# EAGLE design ADM3202_conv (EAGLE 7.7.0)
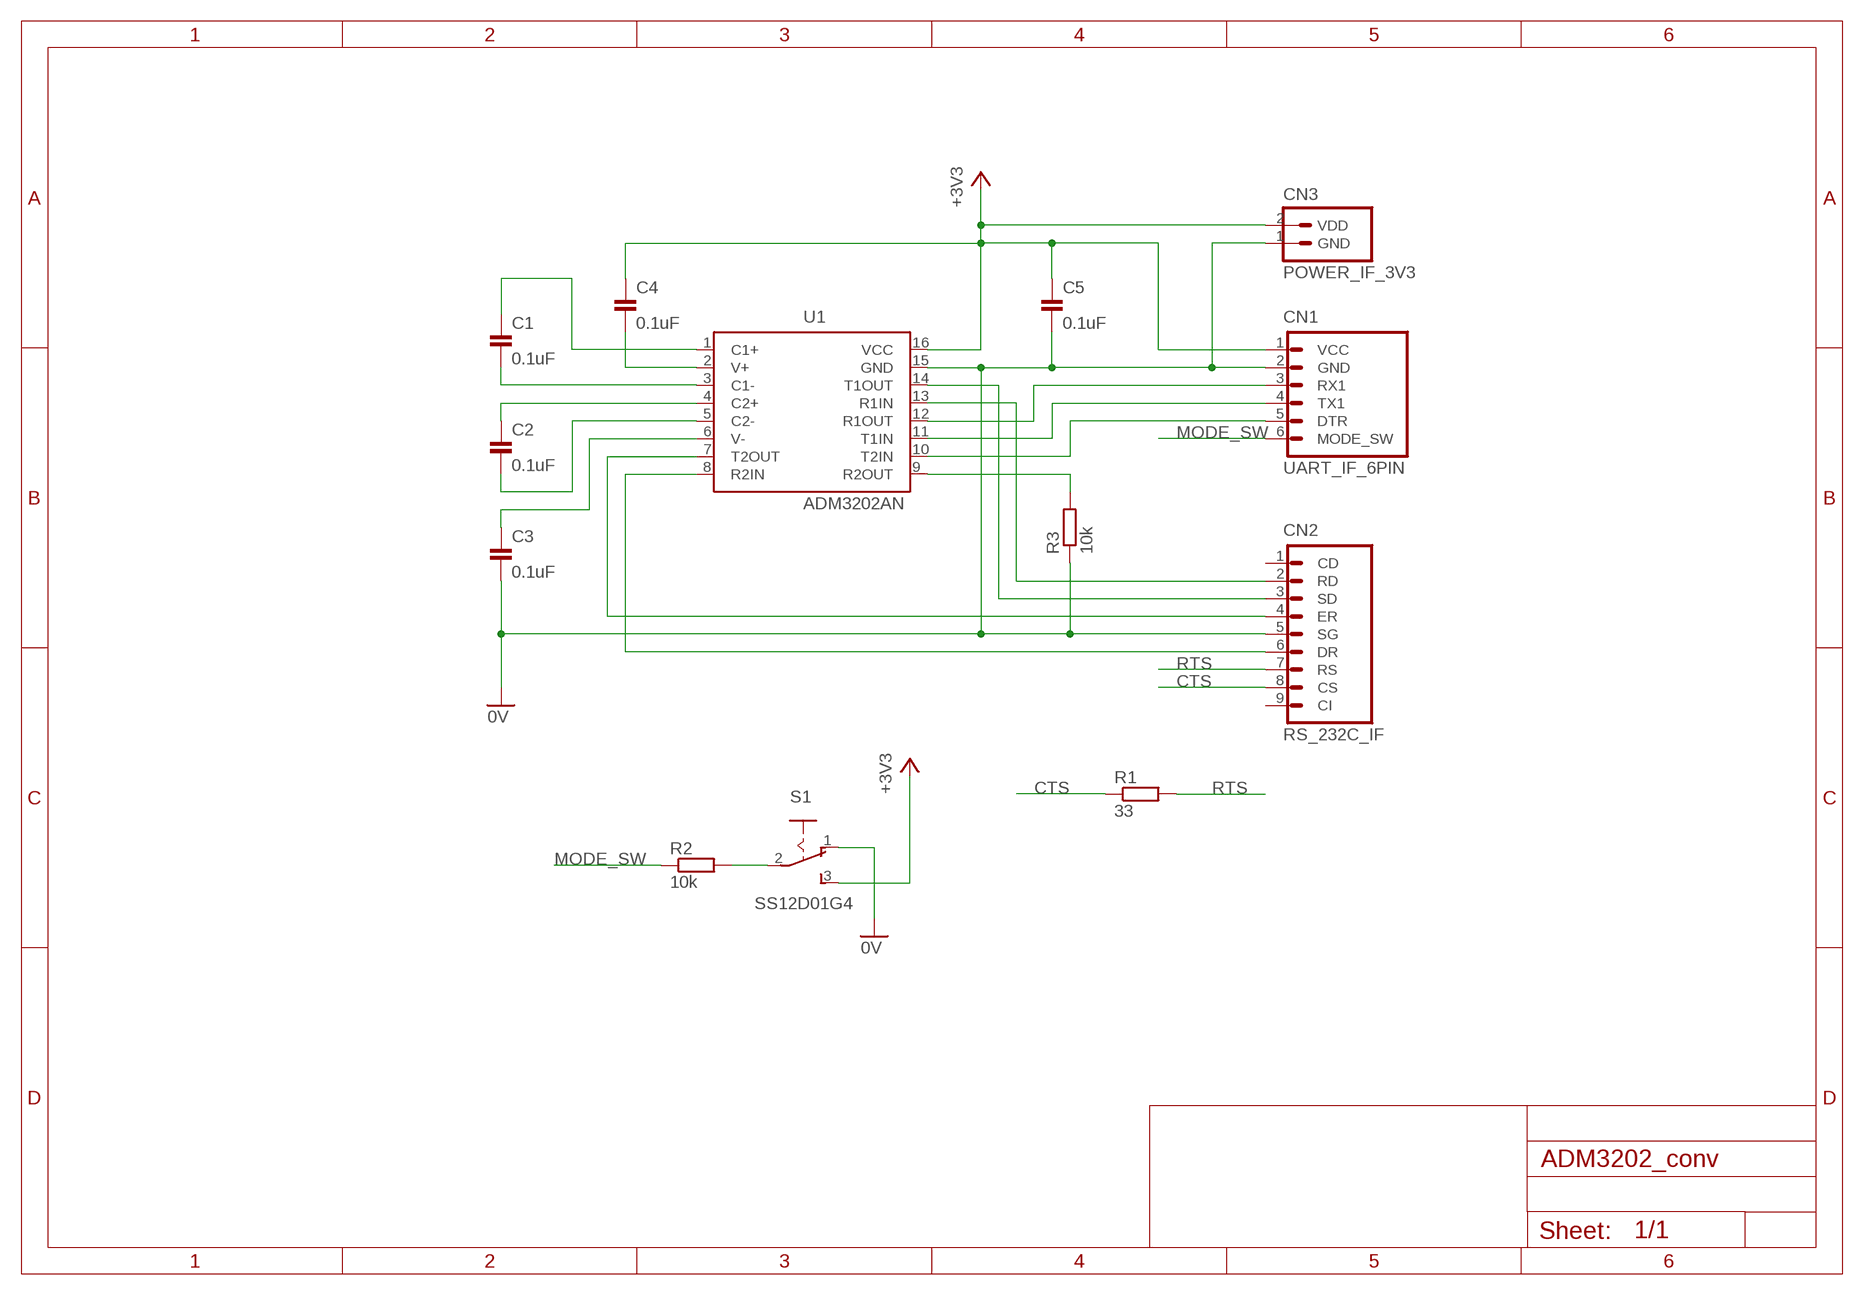
[diagram p0: schematic, sheet 1]

## Parts
C1  0.1uF  CAP_0805_DEV  [SMD_2012_DEV]
C2  0.1uF  CAP_0805_DEV  [SMD_2012_DEV]
C3  0.1uF  CAP_0805_DEV  [SMD_2012_DEV]
C4  0.1uF  CAP_0805_DEV  [SMD_2012_DEV]
C5  0.1uF  CAP_0805_DEV  [SMD_2012_DEV]
CN1  UART_IF_6PIN  [UART_IF_6PIN]
CN2  RS_232C_IF  UM04_RS_232C_IF  [UM04_RS_232C_IF_9PIN]
CN3  POWER_IF_3V3  [HEADER_2PIN_3V3_IF]
R1  33  RESISTOR_300MIL  [RESISTOR_0207_300MIL]
R2  10k  RESISTOR_0805_DEV  [SMD_2012_DEV]
R3  10k  RESISTOR_0805_DEV  [SMD_2012_DEV]
S1  SS12D01G4  [SLIDE_SWITCH_1C]
U1  ADM3202AN  [DIL16]

## Nets
0V: C3.2 C5.2 CN1.2(GND) CN2.5(SG) CN3.1(GND) R3.1 S1.1(O) U1.15(GND)
+3V3: C4.1 C5.1 CN1.1(VCC) CN3.2(VDD) S1.3(S) U1.16(VCC)
CTS: CN2.8(CS) R1.1
MODE_SW: CN1.6(MODE_SW) R2.1
N$1: C1.2 U1.3(C1-)
N$2: C1.1 U1.1(C1+)
N$3: CN2.3(SD) U1.14(T1OUT)
N$4: C3.1 U1.6(V-)
N$5: C2.1 U1.4(C2+)
N$6: C2.2 U1.5(C2-)
N$7: C4.2 U1.2(V+)
N$9: CN2.2(RD) U1.13(R1IN)
N$11: CN1.3(RX1) U1.12(R1OUT)
N$12: CN1.4(TX1) U1.11(T1IN)
N$13: R3.2 U1.9(R2OUT)
N$15: CN1.5(DTR) U1.10(T2IN)
N$16: CN2.4(ER) U1.7(T2OUT)
N$17: CN2.6(DR) U1.8(R2IN)
N$26: R2.2 S1.2(P)
RTS: CN2.7(RS) R1.2
Unconnected: CN2.1(CD) CN2.9(CI)

## Library data of the parts
C1-C5 = Parts:CAP: コンデンサー
CN1 = PartsForProto:UART_IF_6PIN: 電源付きUARTインターフェース
CN2 = PartsForProto:UM04_RS_232C_IF: UM04接続用インターフェース
CN3 = PartsForProto:POWER_IF: 電源供給インターフェース
R1-R3 = Parts:RESISTOR: 抵抗器
S1 = PartsForProto:SS12D01G4: 小型スライドスイッチ １回路２接点 ■基板取付用小型スライドスイッチ ■１回路２接点 ■容量：０．３Ａ５０ＶＤＣ ■絶縁抵抗：１００ＭΩ（５００ＶＤＣ） ■接点抵抗：３０ｍΩ
U1 = Parts:ADM3202A: 3.3V RS-232Cラインドライバ／レシーバ

## Board
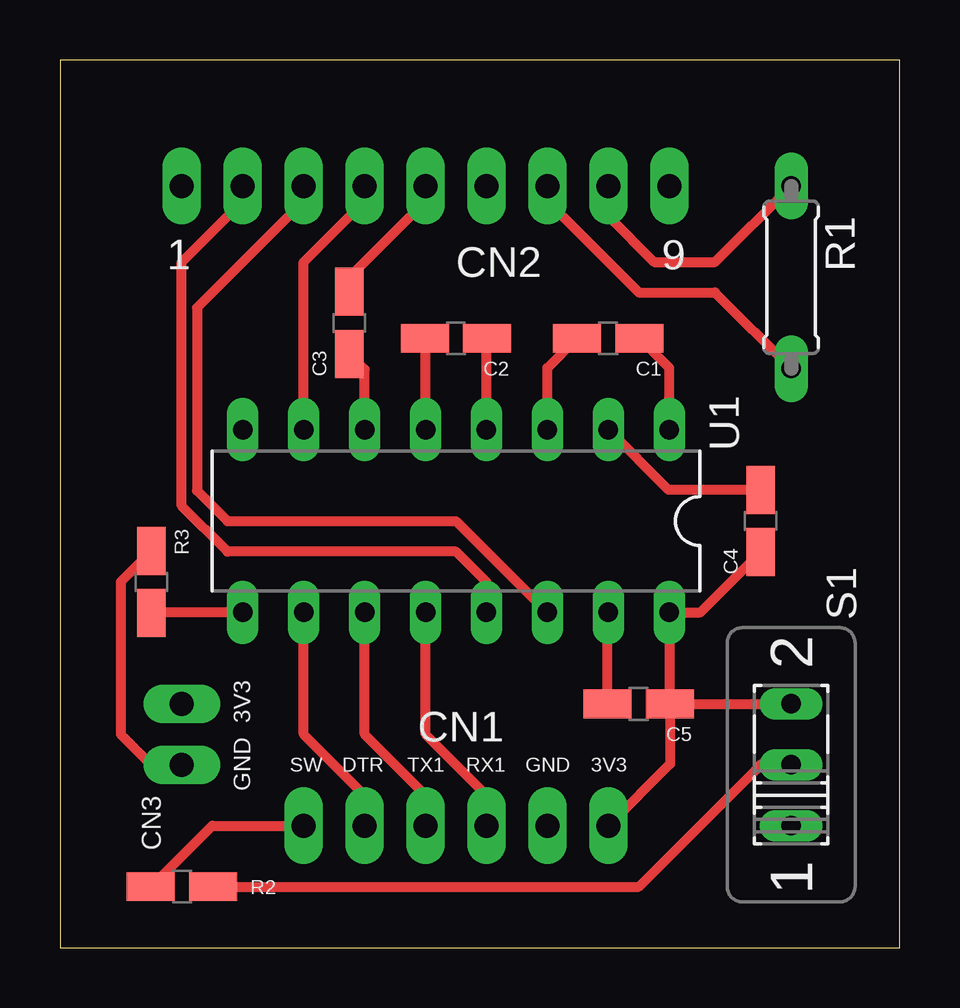
[diagram p1: board, top side]
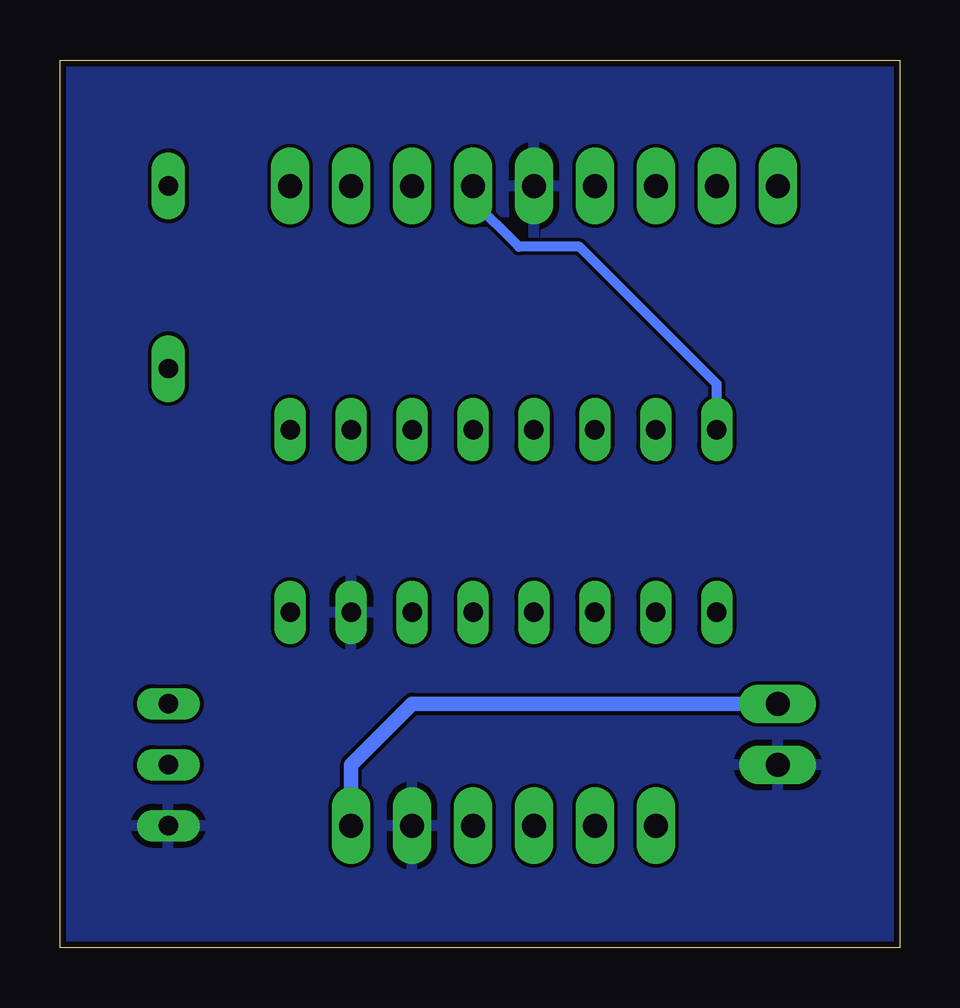
[diagram p2: board, bottom side, seen from below]

Size 35 x 37 mm. Coordinates in mm from the lower left corner, seen from the top.
Outline: 0,0 35,0 35,37 0,37 0,0
Copper layers (1*16): Top 0.035mm / dielectric 1.5mm / Bottom 0.035mm
Design rules "SeeedStudio_2layer_DRU_no_angle_20140221": minimum track width 6mil, minimum drill 12mil, track to track 6mil, track to pad 6mil, pad to pad 6mil, via to via 6mil, smd to smd 0mil, copper to edge 10mil, drill to drill 10mil, minimum pad ring 10mil, minimum via ring 6mil, stop-mask expansion 2mil, vias tented up to drill 100mil, thermal gap 10mil

### Footprints (pad centres in the part's own frame; a part is rotated, then mirrored left to right if it is on the bottom)
SMD_2012_DEV = smd 2 x 1.2: 1 -1.3,0; 2 1.3,0
UART_IF_6PIN = drill 1 pad 1.6 long: 1 0,0; 2 2.54,0; 3 5.08,0; 4 7.62,0; 5 10.16,0; 6 12.7,0
UM04_RS_232C_IF_9PIN = drill 1 pad 1.6 long: 1 0,0; 2 2.54,0; 3 5.08,0; 4 7.62,0; 5 10.16,0; 6 12.7,0; 7 15.24,0; 8 17.78,0; 9 20.32,0
HEADER_2PIN_3V3_IF = drill 1 pad 1.6 long: 1 0,0; 2 2.54,0
RESISTOR_0207_300MIL = drill 0.8 pad 1.4 long: 1 0,0; 2 7.62,0
SLIDE_SWITCH_1C = drill 0.813 long: 1 -2.54,0; 2 0,0; 3 2.54,0
DIL16 = drill 0.813 long: 1 0,0; 2 2.54,0; 3 5.08,0; 4 7.62,0; 5 10.16,0; 6 12.7,0; 7 15.24,0; 8 17.78,0; 9 17.78,7.62; 10 15.24,7.62; 11 12.7,7.62; 12 10.16,7.62; 13 7.62,7.62; 14 5.08,7.62; 15 2.54,7.62; 16 0,7.62

### Placement (x,y rotation side)
C1  22.86,25.4 180 top
C2  16.51,25.4 180 top
C3  12.06,26.04 90 top
C4  29.21,17.78 90 top
C5  24.13,10.16 180 top
CN1  22.86,5.08 180 top
CN2  5.08,31.75 0 top
CN3  5.08,7.62 90 top
R1  30.48,31.75 270 top
R2  5.08,2.54 0 top
R3  3.81,15.24 270 top
S1  30.48,7.62 90 top
U1  25.4,21.59 180 top

### Tracks (layer width: path | path; a pad name or v marks a point on that pad's centre or on a via)
0V
  Top 0.406: C5.2 22.83,13.94 U1.15 | C3.2 12.06,27.94 15.24,31.11 CN2.5 | R3.1 3.81,16.51 2.54,15.24 2.54,8.89 3.81,7.62 CN3.1
  pour Bottom: -1.27,38.1 35.56,38.1 35.56,-1.27 -1.27,-1.27
+3V3
  Top 0.406: C5.1 25.43,13.94 U1.16 26.7,13.97 C4.1 | C5.1 25.43,7.65 CN1.1 | C5.1 S1.3
  Bottom 0.61: CN1.1 22.86,7.62 20.32,10.16 CN3.2
CTS
  Top 0.406: CN2.8 22.86,30.48 24.77,28.57 27.3,28.57 R1.1
MODE_SW
  Top 0.406: R2.1 3.81,2.54 6.35,5.08 CN1.6
N$1
  Top 0.406: U1.3 20.32,24.16 C1.2
N$2
  Top 0.406: U1.1 25.4,24.16 C1.1
N$3
  Top 0.406: CN2.3 10.16,31.11 5.71,26.67 5.71,19.05 6.99,17.78 16.51,17.78 U1.14
N$4
  Top 0.406: U1.6 12.7,24.1 C3.1
N$5
  Top 0.406: U1.4 17.78,25.37 C2.1
N$6
  Top 0.406: U1.5 15.24,25.37 C2.2
N$7
  Top 0.406: C4.2 25.37,19.08 U1.2
N$9
  Top 0.406: U1.13 17.78,15.24 16.51,16.51 6.99,16.51 5.08,18.41 5.08,28.57 7.62,31.11 CN2.2
N$11
  Top 0.406: CN1.3 17.78,6.35 15.24,8.89 U1.12
N$12
  Top 0.406: CN1.4 15.24,6.35 12.7,8.89 U1.11
N$13
  Top 0.406: U1.9 3.84,13.97 R3.2
N$15
  Top 0.406: CN1.5 12.7,6.35 10.16,8.89 U1.10
N$16
  Top 0.406: CN2.4 12.7,31.11 10.16,28.57 U1.7
N$17
  Bottom 0.406: U1.8 7.62,23.5 13.34,29.21 15.88,29.21 17.78,31.11 CN2.6
N$26
  Top 0.406: R2.2 24.13,2.54 29.21,7.62 S1.2
RTS
  Top 0.406: CN2.7 20.32,31.11 24.13,27.3 27.3,27.3 R1.2